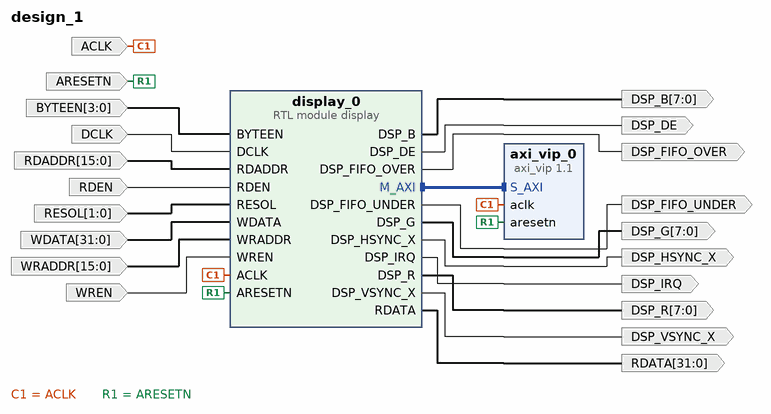
[diagram p0: block diagram of the top level]
# Vivado block design design_1, xc7z020clg484-1, Vivado 2022.2
create_bd_design design_1

create_bd_port -dir I -type clk ACLK
create_bd_port -dir I -type rst ARESETN
create_bd_port -dir I -from 3 -to 0 BYTEEN
create_bd_port -dir I DCLK
create_bd_port -dir O -from 7 -to 0 DSP_B
create_bd_port -dir O DSP_DE
create_bd_port -dir O DSP_FIFO_OVER
create_bd_port -dir O DSP_FIFO_UNDER
create_bd_port -dir O -from 7 -to 0 DSP_G
create_bd_port -dir O DSP_HSYNC_X
create_bd_port -dir O -type intr DSP_IRQ
create_bd_port -dir O -from 7 -to 0 DSP_R
create_bd_port -dir O DSP_VSYNC_X
create_bd_port -dir I -from 15 -to 0 RDADDR
create_bd_port -dir O -from 31 -to 0 RDATA
create_bd_port -dir I RDEN
create_bd_port -dir I -from 1 -to 0 RESOL
create_bd_port -dir I -from 31 -to 0 WDATA
create_bd_port -dir I -from 15 -to 0 WRADDR
create_bd_port -dir I WREN

create_bd_cell -type ip -vlnv xilinx.com:ip:axi_vip:1.1 axi_vip_0
set_property -dict {CONFIG.INTERFACE_MODE SLAVE} [get_bd_cells axi_vip_0]
create_bd_cell -type module -reference display display_0

# ---- connections ----

connect_bd_intf_net [get_bd_intf_pins axi_vip_0/S_AXI] [get_bd_intf_pins display_0/M_AXI]
connect_bd_net -net ACLK_0_1 [get_bd_ports ACLK] [get_bd_pins axi_vip_0/aclk] [get_bd_pins display_0/ACLK]
connect_bd_net -net ARESETN_0_1 [get_bd_ports ARESETN] [get_bd_pins axi_vip_0/aresetn] [get_bd_pins display_0/ARESETN]
connect_bd_net -net BYTEEN_0_1 [get_bd_ports BYTEEN] [get_bd_pins display_0/BYTEEN]
connect_bd_net -net DCLK_0_1 [get_bd_ports DCLK] [get_bd_pins display_0/DCLK]
connect_bd_net -net RDADDR_0_1 [get_bd_ports RDADDR] [get_bd_pins display_0/RDADDR]
connect_bd_net -net RDEN_0_1 [get_bd_ports RDEN] [get_bd_pins display_0/RDEN]
connect_bd_net -net RESOL_0_1 [get_bd_ports RESOL] [get_bd_pins display_0/RESOL]
connect_bd_net -net WDATA_0_1 [get_bd_ports WDATA] [get_bd_pins display_0/WDATA]
connect_bd_net -net WRADDR_0_1 [get_bd_ports WRADDR] [get_bd_pins display_0/WRADDR]
connect_bd_net -net WREN_0_1 [get_bd_ports WREN] [get_bd_pins display_0/WREN]
connect_bd_net [get_bd_pins display_0/DSP_B] [get_bd_ports DSP_B]
connect_bd_net [get_bd_pins display_0/DSP_DE] [get_bd_ports DSP_DE]
connect_bd_net [get_bd_pins display_0/DSP_FIFO_OVER] [get_bd_ports DSP_FIFO_OVER]
connect_bd_net [get_bd_pins display_0/DSP_FIFO_UNDER] [get_bd_ports DSP_FIFO_UNDER]
connect_bd_net [get_bd_pins display_0/DSP_G] [get_bd_ports DSP_G]
connect_bd_net [get_bd_pins display_0/DSP_HSYNC_X] [get_bd_ports DSP_HSYNC_X]
connect_bd_net [get_bd_pins display_0/DSP_IRQ] [get_bd_ports DSP_IRQ]
connect_bd_net [get_bd_pins display_0/DSP_R] [get_bd_ports DSP_R]
connect_bd_net [get_bd_pins display_0/DSP_VSYNC_X] [get_bd_ports DSP_VSYNC_X]
connect_bd_net [get_bd_pins display_0/RDATA] [get_bd_ports RDATA]

# ---- address map ----
assign_bd_address -offset 0x44A00000 -range 64K -target_address_space [get_bd_addr_spaces display_0/M_AXI] [get_bd_addr_segs axi_vip_0/S_AXI/Reg]

validate_bd_design
save_bd_design
